# EasyEDA Pro project FPGA拓展板.epro

# Schematic Schematic1
Board Name: Board1; Create Date: 2025-09-13; Page Name: P1; Project Name: FPGA改; Schematic Name: Schematic1; Update Date: 2025-11-01; 项目名称: 111
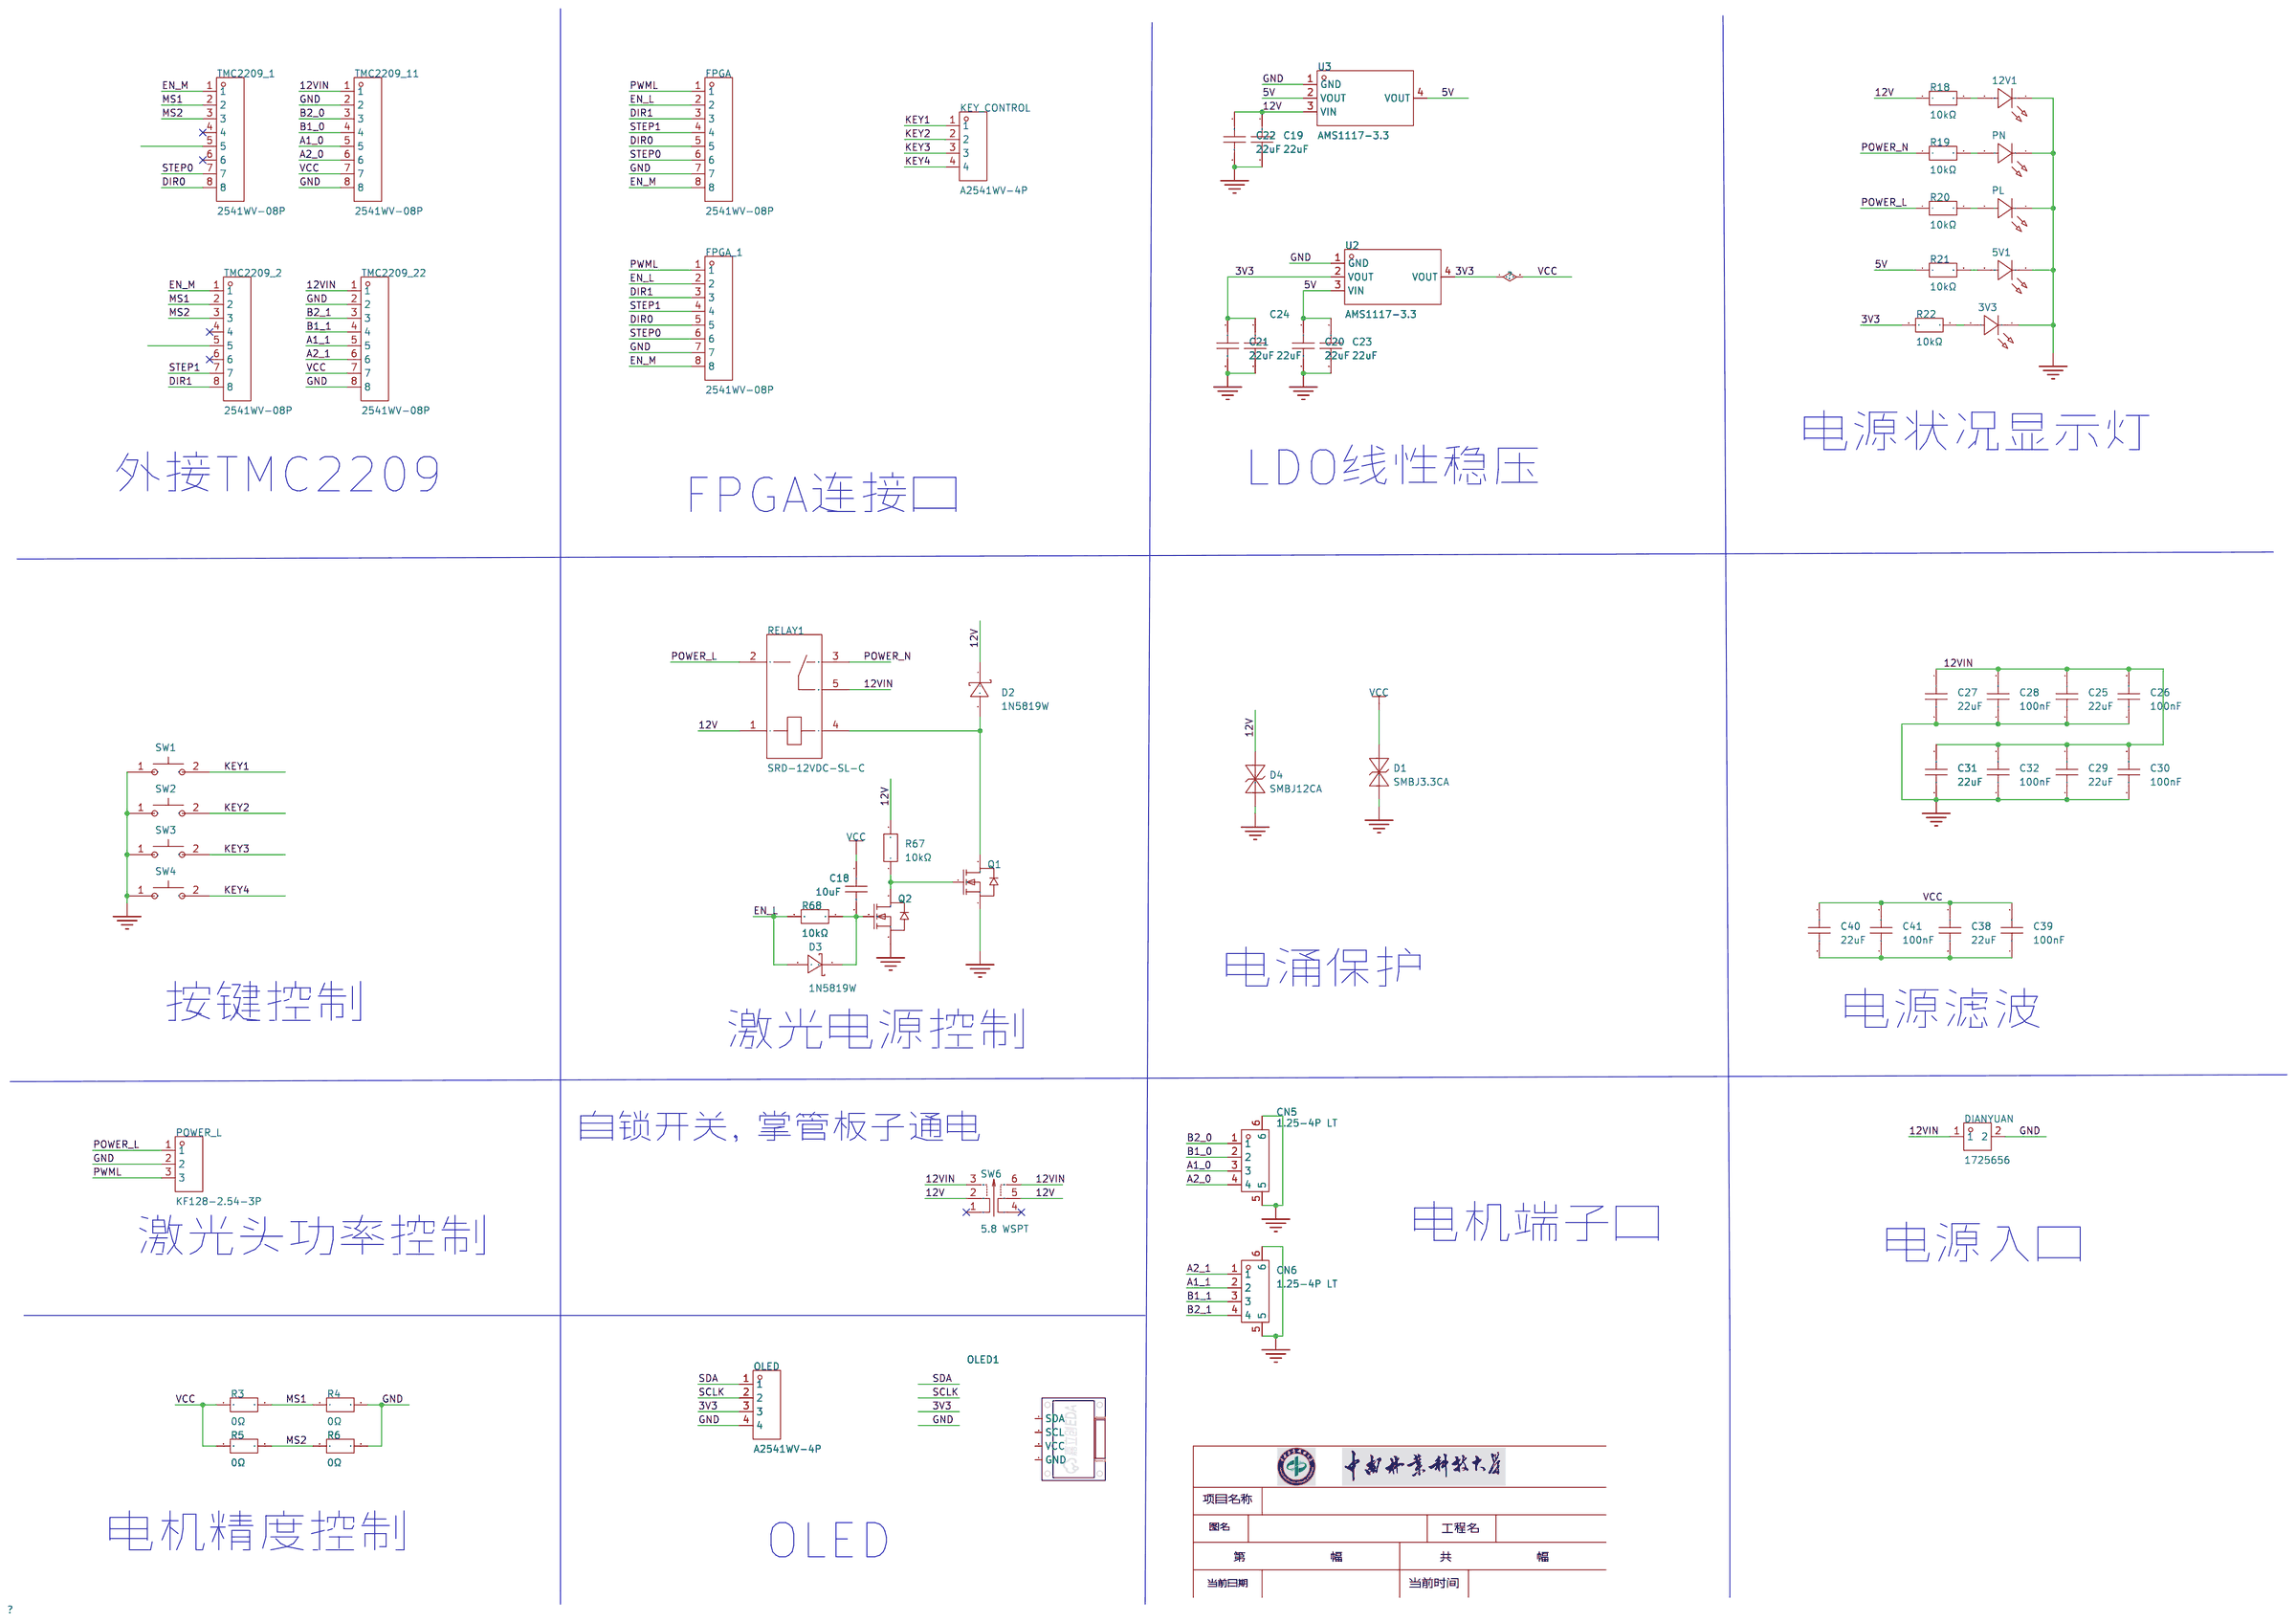
[diagram p0: schematic sheet]

## Parts
3V3  YLED0805R  [LED0603_GREEN]
5V1  YLED0805R  [LED0603_GREEN]
12V1  YLED0805R  [LED0603_GREEN]
C18  10uF  [C0805]
C19  22uF  [C0805]
C20  22uF  [C0805]
C21  22uF  [C0805]
C22  22uF  [C0805]
C23  22uF  [C0805]
C24  22uF  [C0805]
C25  22uF  [C0805]
C26  100nF  [C0603]
C27  22uF  [C0805]
C28  100nF  [C0603]
C29  22uF  [C0805]
C30  100nF  [C0603]
C31  22uF  [C0805]
C32  100nF  [C0603]
C38  22uF  [C0805]
C39  100nF  [C0603]
C40  22uF  [C0805]
C41  100nF  [C0603]
CN5  1.25-4P LT  [CONN-SMD_1.25-4PLT]
CN6  1.25-4P LT  [CONN-SMD_1.25-4PLT]
D1  SMBJ3.3CA  [SMB_L4.4-W3.5-LS5.2-BI]
D2  1N5819W  [SOD-123F_L2.8-W1.8-LS3.7-RD]
D3  1N5819W  [SOD-123F_L2.8-W1.8-LS3.7-RD]
D4  SMBJ12CA  [SMB_L4.4-W3.5-LS5.2-BI]
DIANYUAN  1725656  [CONN-TH_2P-P2.54_1725656]
FPGA  2541WV-08P  [HDR-TH_8P-P2.54-V-M-4]
FPGA_1  2541WV-08P  [HDR-TH_8P-P2.54-V-M-4]
KEY_CONTROL  A2541WV-4P  [HDR-TH_4P-P2.54-V-M]
OLED  A2541WV-4P  [HDR-TH_4P-P2.54-V-M]
OLED1  -  [0.96OLED_4P]
PL  YLED0805R  [LED0603_GREEN]
PN  YLED0805R  [LED0603_GREEN]
POWER_L  KF128-2.54-3P  [CONN-TH_3P-P2.54_KF128-2.54-3P]
Q1  AO3400  [SOT-23-3_L2.9-W1.3-P1.90-LS2.4-BL-2]
Q2  AO3400  [SOT-23-3_L2.9-W1.3-P1.90-LS2.4-BL-2]
R3  0Ω  [R0603]
R4  0Ω  [R0603]
R5  0Ω  [R0603]
R6  0Ω  [R0603]
R18  10kΩ  [R0603]
R19  10kΩ  [R0603]
R20  10kΩ  [R0603]
R21  10kΩ  [R0603]
R22  10kΩ  [R0603]
R67  10kΩ  [R0603]
R68  10kΩ  [R0603]
RELAY1  SRD-12VDC-SL-C  [RELAY-TH_SRD-XXVDC-XL-C]
SW1  TS-1807R-2016  [SW-SMD_L4.0-W2.9-LS4.8-1]
SW2  TS-1807R-2016  [SW-SMD_L4.0-W2.9-LS4.8-1]
SW3  TS-1807R-2016  [SW-SMD_L4.0-W2.9-LS4.8-1]
SW4  TS-1807R-2016  [SW-SMD_L4.0-W2.9-LS4.8-1]
SW6  5.8 WSPT  [SW-TH_6P-L5.8-W5.8-P2.00-LS4.5-TL_K8-5851E-L1]
TMC2209_1  2541WV-08P  [HDR-TH_8P-P2.54-V-M-4]
TMC2209_2  2541WV-08P  [HDR-TH_8P-P2.54-V-M-4]
TMC2209_11  2541WV-08P  [HDR-TH_8P-P2.54-V-M-4]
TMC2209_22  2541WV-08P  [HDR-TH_8P-P2.54-V-M-4]
U2  AMS1117-3.3  [SOT-223-3_L6.5-W3.4-P2.30-LS7.0-BR]
U3  AMS1117-3.3  [SOT-223-3_L6.5-W3.4-P2.30-LS7.0-BR]

## Library data of the parts
3V3 5V1 12V1 PL PN = YLED0805R: 发光颜色:红色;正向电压(VF):1.8V~2.4V;功率:60mW;正向电流:20mA;主波长:615nm~630nm;二极管配置:-;透镜颜色:-;色温:-;发光强度:-;发光角度:-;载带方式:-;工作温度:-40℃~+85℃;; Supplier Part: C19171391; Manufacturer: YONGYUTAI(永裕泰); Supplier Footprint: 0805; JLCPCB Part Class: 扩展库; Datasheet: https://atta.szlcsc.com/upload/public/pdf/source/20231027/AB486D22E6D71BC59190C48A798367E6.pdf; Supplier: LCSC; Emitted Color: 红色; Forward Voltage (VF): 1.8V~2.4V; Power Dissipation: 60mW; Forward Current: 20mA; Dominant Wavelength: 615nm~630nm; Peak Wavelength: 645nm; Operating Temperature: -40℃~+85℃
C18-C25 C27 C29 C31 C38 C40 = 0603B104J250NT: 容值:100nF;精度:±5%;额定电压:25V;材质(温度系数):X7R;; LCSC Part Name: 100nF ±5% 25V; Supplier Part: C2991729; Manufacturer: FH(风华); Supplier Footprint: 0603; JLCPCB Part Class: 扩展库; Datasheet: https://atta.szlcsc.com/upload/public/pdf/source/20200305/C486355_26A10D38EF8C2A5C37091D0039909270.pdf; Supplier: LCSC; Tolerance: ±5%; Voltage Rated: 25V; Temperature Coefficient: X7R
C26 C28 C30 C32 C39 C41 = CGA0805X7R104K500KT: 容值:100nF;精度:±10%;额定电压:50V;材质(温度系数):X7R;; LCSC Part Name: 100nF ±10% 50V; Supplier Part: C7503486; Manufacturer: HRE(芯声); Supplier Footprint: 0805; Supplier: LCSC; Tolerance: ±10%; Voltage Rated: 50V; Temperature Coefficient: X7R
CN5 CN6 = 1.25-4P LT: 插针结构:1x4P;间距:1.25mm;安装方式:立贴;参考系列:-;总PIN数:4P;排数:1;每排PIN数:4;行距:-;额定电流:1A;工作温度范围:-25℃~+85℃;; LCSC Part Name: 1x4P 间距:1.25mm 立贴; Supplier Part: C668611; Manufacturer: SHOU HAN(首韩); Supplier Footprint: SMD,P=1.25mm; JLCPCB Part Class: 扩展库; Datasheet: https://atta.szlcsc.com/upload/public/pdf/source/20200618/C668611_026C7E584C914A0046DD44314B22D2A4.pdf; Supplier: LCSC; Pins Structure: 1x4P; Pitch: 1.25mm; Mounting Style: 立贴; Number of Pins: 4P; Number of Rows: 1; Number of PINs Per Row: 4; Current Rating (Max): 1A; Operating Temperature Range: -25℃~+85℃
D1 D4 = SMBJ3.3CA_C5125668: 极性:双向;反向截止电压(Vrwm):3.3V;最大钳位电压:7.3V@50A;峰值脉冲电流(Ipp)@10/1000us:50A;峰值脉冲功率(Ppp)@10/1000us:600W;击穿电压:4.15V;; LCSC Part Name: TVS二极管; Supplier Part: C5125668; Manufacturer: BORN(伯恩半导体); Supplier Footprint: SMB(DO-214AA); JLCPCB Part Class: 扩展库; Datasheet: https://atta.szlcsc.com/upload/public/pdf/source/20231010/D8DA1EA3E2089A4B7A39163387B49BE4.pdf; Supplier: LCSC; polarity: 双向; Reverse Stand-Off Voltage (Vrwm): 3.3V; Maximum Clamping Voltage: 7.3V@50A; Peak Pulse Current (Ipp)@10/1000us: 50A; Peak Pulse Power Dissipation (Ppp)@10/1000us: 600W; Breakdown Voltage: 4.15V; Reverse Leakage Current (Ir): 20nA; Type: TVS
D2 D3 = 1N5819W_C169540: 正向压降(Vf):600mV@1A;直流反向耐压(Vr):40V;平均整流电流(Io):1A;; LCSC Part Name: 电压:40V 电流:1A; Supplier Part: C169540; Manufacturer: 晶导微电子; Supplier Footprint: SOD-123F; JLCPCB Part Class: 扩展库; Datasheet: https://atta.szlcsc.com/upload/public/pdf/source/20180316/CADAC6127F7EB1C6F7CC209B8BEF97B8.pdf; Supplier: LCSC; Forward Voltage (Vf@If): 600mV@1A; Reverse Voltage (Vr): 40V; Average Rectified Current (Io): 1A
DIANYUAN = 1725656: 间距:2.54mm;颜色:绿色;安装方式:直插;额定电流:6A;额定电压:125V;排数:1;每排PIN数:2;; LCSC Part Name: 2.54mm 排数:1 每排P数:2 直插; Supplier Part: C3029316; Manufacturer: Phoenix Contact(菲尼克斯); Supplier Footprint: 插件,P=2.54mm; JLCPCB Part Class: 扩展库; Datasheet: https://atta.szlcsc.com/upload/public/pdf/source/20220527/B7919393CBFBC9656D3D21F67F098F52.pdf; Supplier: LCSC; Pitch: 2.54mm; Color: 绿色; Mounting Style: 直插; Current Rating (Max): 6A; Voltage Rating (Max): 125V; Number of Pins: 2P; Number of Rows: 1; Number of PINs Per Row: 2
FPGA FPGA_1 TMC2209_1 TMC2209_2 TMC2209_11 TMC2209_22 = 2541WV-08P: 2.54间距单排直插插排针，塑高2.54，上针长度6.0，下针长3.0,08P; Supplier Part: C5383116; Manufacturer: HanElectricity(瀚源); Supplier Footprint: 插件,P=2.54mm; Datasheet: https://atta.szlcsc.com/upload/public/pdf/source/20230330/2BC52F76E32B2D45ECCE68ADA82449DD.pdf; Supplier: LCSC
KEY_CONTROL OLED = A2541WV-4P: 间距:2.54mm;总PIN位数:4;排数:1;插针结构:1x4P;行距:-;安装类型:直插;圆针/方针:方针;额定电流:-;额定电压:-;配合针长度:6mm;塑高:2.54mm;端接针长度:3mm;触头材质:黄铜;触头镀层:-;工作温度范围:-40℃~+105℃;颜色:黑色;; LCSC Part Name: 2.54mm 1x4P 直插 方针; Supplier Part: C225479; Manufacturer: CJT(长江连接器); Supplier Footprint: 直插,P=2.54mm; JLCPCB Part Class: Extended Part; Datasheet: https://atta.szlcsc.com/upload/public/pdf/source/20210317/C225479_66BE1F584C1491F50F59A7D7B65E2652.pdf; Supplier: LCSC; Pitch: 2.54mm; Number of Pins: 4; Number of Rows: 1; Pin Structure: 1x4P; Mounting Type: 直插; Circluar Pins/Square Pins: 方针; Length of Mating Pin: 6mm; Insulation Height: 2.54mm; Length of End Connection Pin: 3mm; Contact Material: 黄铜; Operating Temperature Range: -40℃~+105℃; Color: 黑色
OLED1 = 0.96OLED模块_4P: Supplier Footprint: 插件
POWER_L = KF128-2.54-3P: 结构:1x3P;间距:2.54mm;颜色:绿色;安装方式:直插;额定电流:8A;额定电压:130V;排数:1;线规 - AWG:18~26;线规 - 平方毫米:1;每排PIN数:3;工作温度范围:-40℃~+105℃;; LCSC Part Name: 2.54mm 1x3P 排数:1 每排P数:3 直插; Supplier Part: C474921; Manufacturer: KEFA(科发); Supplier Footprint: 插件,P=2.54mm; JLCPCB Part Class: 扩展库; Datasheet: https://atta.szlcsc.com/upload/public/pdf/source/20230317/0E5ECA9DB49110BC3219D12632CEA6EE.pdf; Supplier: LCSC; Structure: 1x3P; Pitch: 2.54mm; Color: 绿色; Mounting Style: 直插; Current Rating (Max): 8A; Voltage Rating (Max): 130V; Number of Pins: 3P; Number of Rows: 1; Wire Gauge - AWG: 18~26; Wire Gauge - mm2: 1; Number of PINs Per Row: 3; Operating Temperature Range: -40℃~+105℃
Q1 Q2 = AO3400: Supplier Part: C9900013365; Supplier Footprint: SOT-23; JLCPCB Part Class: 扩展库; Supplier: LCSC
R3-R6 R18-R22 R67 R68 = APC0805T1K00Z: 电阻类型:薄膜电阻;阻值:1kΩ;精度:±0.01%;功率:100mW;温度系数:±5ppm/℃;; LCSC Part Name: 薄膜电阻 1kΩ ±0.01% 100mW; Supplier Part: C6465829; Manufacturer: Ohmite; Supplier Footprint: 0805; Supplier: LCSC; Type: 薄膜电阻; Tolerance: ±0.01%; Power(Watts): 100mW; Temperature Coefficient: ±5ppm/℃; Operating Temperature Range: -55℃~+155℃
RELAY1 = SRD-12VDC-SL-C: 线圈电压:12V;触点形式:一组转换:1C(单刀双掷-转换);触点容量(电阻负载):-;最大切换电压:250V@AC;最大切换电流:15A;; Supplier Part: C30431; Manufacturer: 松乐; Supplier Footprint: 插件,15.6x19.2mm; JLCPCB Part Class: 扩展库; Datasheet: https://atta.szlcsc.com/upload/public/pdf/source/20200305/C490149_C96E4098A3B1FFB377D5AD2E40B7C2A8.pdf; Supplier: LCSC; Coil Voltage: 12V; Contact Form: 一组转换:1C(单刀双掷-转换); Pin Number: 5; Maximum Switching Voltage: 250V@AC; Coil Rated Power: 360mW; Maximum Switching Current: 15A; Coil Type: 无极性-单线圈; Coil Resistance: 400Ω; Contact Resistance: 100mΩ; Operate Time: 10ms; Release Time: 10ms
SW1-SW4 = TS-1807R-2016: 触点电流:25mA;额定电压(DC):24V;电路结构:单刀单掷;安装方式:立贴;作用力:1.6N;机械寿命:6万次;; LCSC Part Name: 4*3*2mm 立贴 轻触开关; Supplier Part: C596278; Manufacturer: SOFNG(硕方); Supplier Footprint: SMD; JLCPCB Part Class: 扩展库; Datasheet: https://atta.szlcsc.com/upload/public/pdf/source/20200609/C596278_4140942BE2C43E125A1525DC6778F69A.pdf; Supplier: LCSC; Contact Current: 25mA; Voltage Rating (DC): 24V; Circuit: 单刀单掷; Mounting Style: 立贴; Actuator Style: 圆形按钮; Actuator/Cap Color: 黑色; Operating Force: 1.6N; Mechanical Life: 6万次; Operating Temperature: -35℃~+75℃; Switch Length: 4mm; Switch Width: 3mm; Switch Height: 2mm
SW6 = 5.8 WSPT: 电路结构:双刀双掷;自锁/无锁:无锁;安装方式:直插;触点电流:100mA;额定电压 (AC):-;额定电压 (DC):30V;带灯:不带;作用力:180gf;机械寿命:5千次;; LCSC Part Name: 按键开关5.8x5.8 无锁平头 180gf; Supplier Part: C5379898; Manufacturer: SHOU HAN(首韩); Supplier Footprint: 插件; Datasheet: https://atta.szlcsc.com/upload/public/pdf/source/20230323/C831DDA43A625CDC196CB35781CDAE7F.pdf; Supplier: LCSC; Circuit: 双刀双掷; Self Lock / No Lock: 无锁; Actuator Style: 矩形柱塞; Mounting Style: 直插; Contact Current: 100mA; Voltage Rating (DC): 30V; Insulation Resistance: 100MΩ; Actuator/Cap Color: 蓝色; With Lamp: 不带; Pin Style: PC引脚; Operating Force: 180gf; Operating Temperature: -10℃~+70℃; Mechanical Life: 5千次
U2 U3 = AMS1117-3.3_C6186: 输出类型:固定;最大输入电压:-;输出电压:3.3V;最大输出电流:1A;电源纹波抑制比(PSRR):72dB@(120Hz);输出极性:正极;; LCSC Part Name: 输出3.3V 1A; Supplier Part: C6186; Manufacturer: AMS; Supplier Footprint: SOT-223-3; JLCPCB Part Class: 基础库; Datasheet: https://atta.szlcsc.com/upload/public/pdf/source/20180727/C6186_7A095716F0823C02F1997A905E26C086.pdf; Supplier: LCSC; Output Type: 固定; Output Voltage: 3.3V; MAX Output Current: 1A; Power Supply Rejection Ratio (PSRR): 72dB@(120Hz); Dropout Voltage: 1.3V@(800mA); Output Polarity: 正极; Number of Outputs: 1

## Nets
5V: C20.1 C23.1 R21.1 U2.3(VIN) U3.2(VOUT) U3.4(VOUT)
12V: C19.1 C22.1 D2.1 D4.2 R18.1 R67.2 RELAY1.1 SW6.2 SW6.5 U3.3(VIN)
12VIN: C25.1 C26.2 C27.1 C28.2 C29.1 C30.2 C31.1 C32.2 DIANYUAN.1 RELAY1.5 SW6.3 SW6.6 TMC2209_11.1 TMC2209_22.1
GND: 3V3.1(K) 5V1.1(K) 12V1.1(K) C19.2 C20.2 C21.2 C22.2 C23.2 C24.2 C25.2 C26.1 C27.2 C28.1 C29.2 C30.1 C31.2 C32.1 CN5.5 CN5.6 CN6.5 CN6.6 D1.1 D4.1 DIANYUAN.2 FPGA.7 FPGA_1.7 OLED.4 PL.1(K) PN.1(K) POWER_L.2 Q1.2(S) Q2.2(S) R4.2 R6.2 SW1.1 SW2.1 SW3.1 SW4.1 TMC2209_11.2 TMC2209_11.8 TMC2209_22.2 TMC2209_22.8 U2.1(GND) U3.1(GND)
VCC: C18.1 C21.1 C24.1 C38.1 C39.2 C40.1 C41.2 D1.2 OLED.3 R3.1 R5.1 R22.1 TMC2209_11.7 TMC2209_22.7 U2.2(VOUT) U2.4(VOUT)
A1_0: CN5.3 TMC2209_11.5
A1_1: CN6.2 TMC2209_22.5
A2_0: CN5.4 TMC2209_11.6
A2_1: CN6.1 TMC2209_22.6
B1_0: CN5.2 TMC2209_11.4
B1_1: CN6.3 TMC2209_22.4
B2_0: CN5.1 TMC2209_11.3
B2_1: CN6.4 TMC2209_22.3
DIR0: FPGA.5 FPGA_1.5 TMC2209_1.8
DIR1: FPGA.3 FPGA_1.3 TMC2209_2.8
EN_L: D3.2 FPGA.2 FPGA_1.2 R68.2
EN_M: FPGA.8 FPGA_1.8 TMC2209_1.1 TMC2209_2.1
KEY1: KEY_CONTROL.1 SW1.2
KEY2: KEY_CONTROL.2 SW2.2
KEY3: KEY_CONTROL.3 SW3.2
KEY4: KEY_CONTROL.4 SW4.2
MS1: R3.2 R4.1 TMC2209_1.2 TMC2209_2.2
MS2: R5.2 R6.1 TMC2209_1.3 TMC2209_2.3
POWER_L: POWER_L.1 R20.1 RELAY1.2
POWER_N: R19.1 RELAY1.3
PWML: FPGA.1 FPGA_1.1 POWER_L.3
SCLK: OLED.2
SDA: OLED.1
STEP0: FPGA.6 FPGA_1.6 TMC2209_1.7
STEP1: FPGA.4 FPGA_1.4 TMC2209_2.7
$1N1478: D2.2 Q1.3(D) RELAY1.4
$1N1491: Q1.1(G) Q2.3(D) R67.1
$1N1495: C18.2 D3.1 Q2.1(G) R68.1
$1N2877: 12V1.2(A) R18.2
$1N2880: 5V1.2(A) R21.2
$1N3529: C38.2 C39.1 C40.2 C41.1
$1N8867: 3V3.2(A) R22.2
Net-(PL-2): PL.2(A) R20.2
Net-(PN-2): PN.2(A) R19.2

Not connected (* = marked no-connect by the designer): OLED1 1(GND) 2(VCC) 3(SCL) 4(SDA); SW6 1* 4*; TMC2209_1 4* 5 6*; TMC2209_2 4* 5 6*

## Notes on the sheet
- 电源状况显示灯
- LDO线性稳压
- 外接TMC2209
- FPGA连接口
- 电涌保护
- 按键控制
- 电源滤波
- 激光电源控制
- 自锁开关，掌管板子通电
- 电机端子口
- 激光头功率控制
- 电源入口
- 电机精度控制
- OLED

# Board PCB1
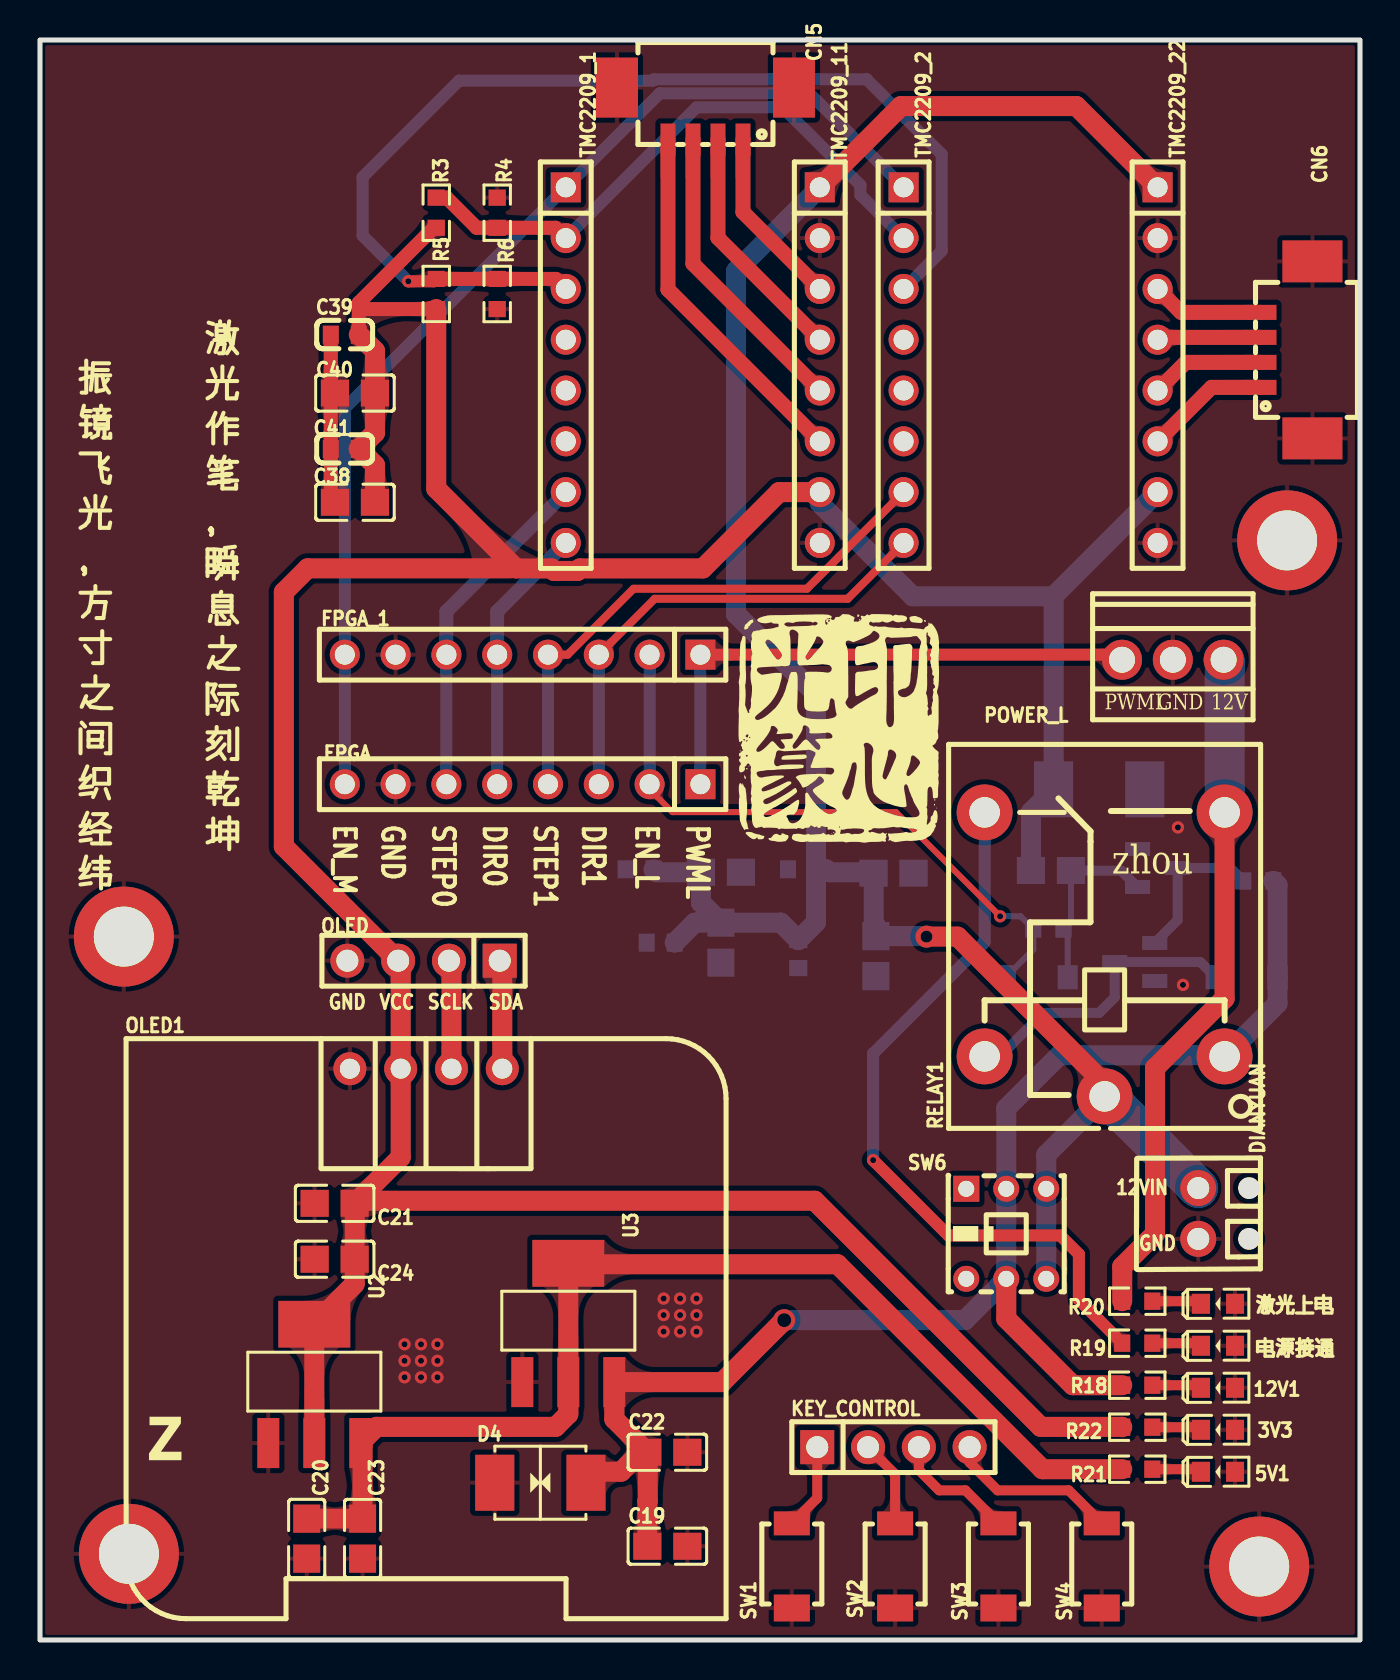
[diagram p1: board, top side]
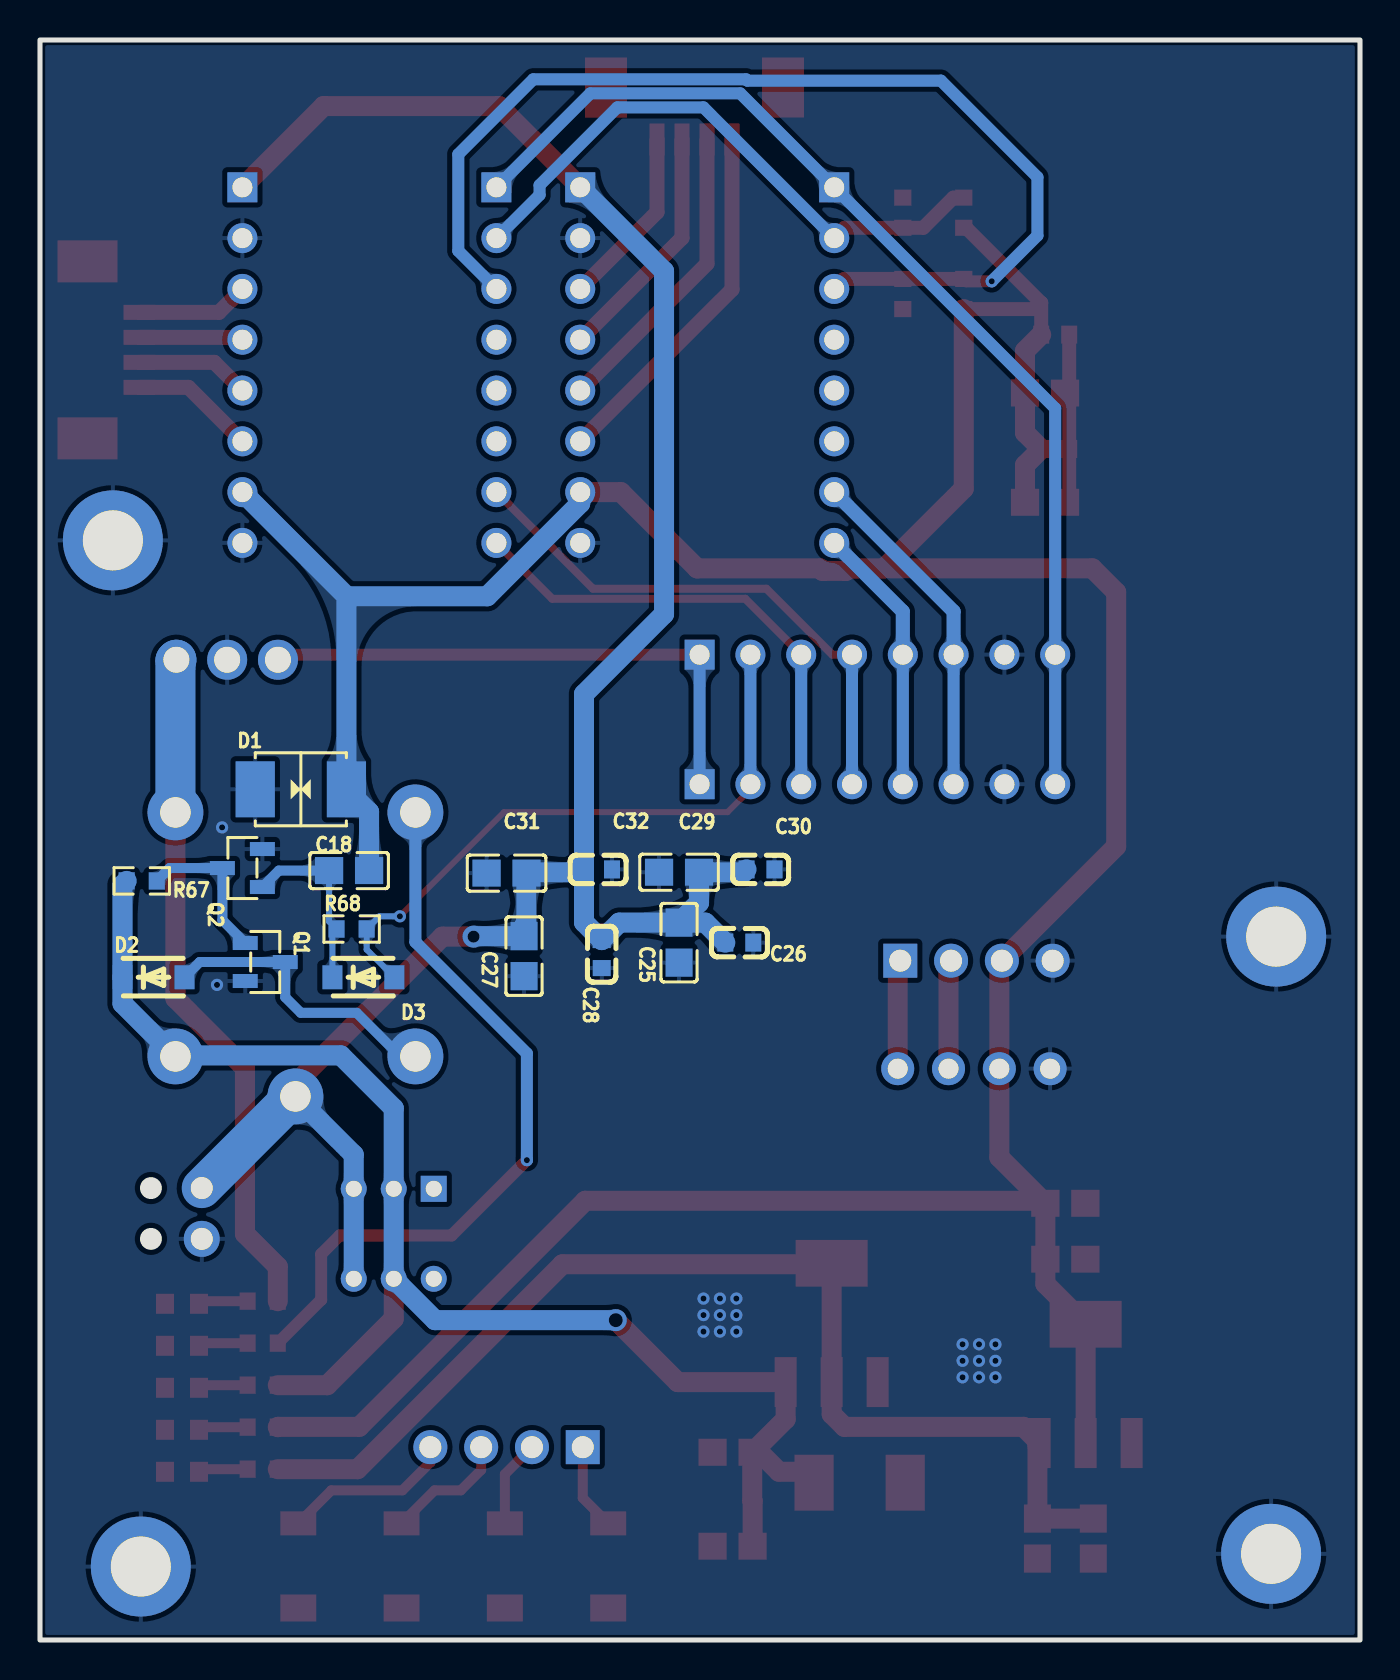
[diagram p2: board, bottom side, seen from below]

Outline 66 x 80 mm; copper layers: Top Layer, Bottom Layer. Coordinates in mm from the lower left corner of the outline.
Outline path: rectangle 0,80 66,0
Stack: Top Layer 0.035mm / Dielectric1 1.51mm FR4 er 4.5 / Bottom Layer 0.035mm

## Design rules (mm)
template: JLCPCB Capability(Two Layers Board)
spacing copperThickness1oz (default): track to track 0.102, other pairs 0.152 to 0.3
spacing copperThickness2oz: track to track 0.203, other pairs 0.152 to 0.3
track width copperThickness1oz (default): min 0.127, default 0.254, max 2.54
track width copperThickness2oz: min 0.203, default 0.254, max 2.54
differential pair differentialPair (default): width min 0.127, default 0.254, max 2.54; gap min 0.152, default 0.152
via viaSize (default): diameter min 0.5, default 0.61, max 10; hole min 0.3, default 0.305, max 6.3

## Placement (name value [footprint] x y rotation side)
3V3  YLED0805R  [LED0603_GREEN]  58.9 10.51 180 top
5V1  YLED0805R  [LED0603_GREEN]  58.9 8.41 180 top
12V1  YLED0805R  [LED0603_GREEN]  58.9 12.61 180 top
C18  10uF  [C0805]  50.55 38.47 0 bottom
C19  22uF  [C0805]  31.37 4.69 0 top
C20  22uF  [C0805]  13.33 5.07 270 top
C21  22uF  [C0805]  14.73 21.83 180 top
C22  22uF  [C0805]  31.37 9.39 0 top
C23  22uF  [C0805]  16.13 5.07 270 top
C24  22uF  [C0805]  14.73 19.04 180 top
C25  22uF  [C0805]  34.05 34.87 270 bottom
C26  100nF  [C0603]  31.04 34.87 0 bottom
C27  22uF  [C0805]  41.8 34.19 270 bottom
C28  100nF  [C0603]  37.91 34.3 90 bottom
C29  22uF  [C0805]  34.05 38.39 0 bottom
C30  100nF  [C0603]  29.98 38.53 0 bottom
C31  22uF  [C0805]  42.67 38.34 0 bottom
C32  100nF  [C0603]  38.1 38.53 0 bottom
C38  22uF  [C0805]  15.75 56.89 180 top
C39  100nF  [C0603]  15.24 65.27 0 top
C40  22uF  [C0805]  15.75 62.35 180 top
C41  100nF  [C0603]  15.24 59.55 0 top
CN5  1.25-4P LT  [CONN-SMD_1.25-4PLT]  33.27 76.32 0 top
CN6  1.25-4P LT  [CONN-SMD_1.25-4PLT]  62.32 64.51 270 top
D1  SMBJ3.3CA  [SMB_L4.4-W3.5-LS5.2-BI]  52.96 42.54 180 bottom
D2  1N5819W  [SOD-123F_L2.8-W1.8-LS3.7-RD]  60.33 33.14 180 bottom
D3  1N5819W  [SOD-123F_L2.8-W1.8-LS3.7-RD]  49.83 33.14 180 bottom
D4  SMBJ12CA  [SMB_L4.4-W3.5-LS5.2-BI]  25.02 7.86 0 top
DIANYUAN  1725656  [CONN-TH_2P-P2.54_1725656]  57.91 21.33 270 top
FPGA  2541WV-08P  [HDR-TH_8P-P2.54-V-M-4]  24.13 42.79 180 top
FPGA_1  2541WV-08P  [HDR-TH_8P-P2.54-V-M-4]  24.13 49.27 180 top
KEY_CONTROL  A2541WV-4P  [HDR-TH_4P-P2.54-V-M]  42.67 9.64 0 top
NOREF  -  [Pad_e449]  4.19 35.17 0 top
NOREF#2  -  [Pad_e502]  4.45 4.31 0 top
NOREF#3  -  [Pad_e452]  60.96 3.67 0 top
NOREF#4  -  [Pad_e451]  62.36 54.98 0 top
OLED  A2541WV-4P  [HDR-TH_4P-P2.54-V-M]  19.18 33.96 180 top
OLED1  -  [0.96OLED_4P]  19.3 28.57 0 top
POWER_L  KF128-2.54-3P  [CONN-TH_3P-P2.54_KF128-2.54-3P]  56.64 49.01 180 top
Q1  AO3400  [SOT-23-3_L2.9-W1.3-P1.90-LS2.4-BL-2]  54.74 33.9 270 bottom
Q2  AO3400  [SOT-23-3_L2.9-W1.3-P1.90-LS2.4-BL-2]  55.88 38.6 90 bottom
R3  0Ω  [R0603]  19.81 71.36 90 top
R4  0Ω  [R0603]  22.86 71.36 90 top
R5  0Ω  [R0603]  19.81 67.3 90 top
R6  0Ω  [R0603]  22.86 67.3 270 top
R18  10kΩ  [R0603]  54.86 12.74 0 top
R19  10kΩ  [R0603]  54.86 14.84 0 top
R20  10kΩ  [R0603]  54.86 16.94 0 top
R21  10kΩ  [R0603]  54.86 8.54 0 top
R22  10kΩ  [R0603]  54.86 10.64 0 top
R67  10kΩ  [R0603]  60.91 37.95 0 bottom
R68  10kΩ  [R0603]  50.42 35.55 180 bottom
RELAY1  SRD-12VDC-SL-C  [RELAY-TH_SRD-XXVDC-XL-C]  53.23 34.28 90 top
SW1  TS-1807R-2016  [SW-SMD_L4.0-W2.9-LS4.8-1]  37.59 3.8 90 top
SW2  TS-1807R-2016  [SW-SMD_L4.0-W2.9-LS4.8-1]  42.76 3.8 90 top
SW3  TS-1807R-2016  [SW-SMD_L4.0-W2.9-LS4.8-1]  47.92 3.8 90 top
SW4  TS-1807R-2016  [SW-SMD_L4.0-W2.9-LS4.8-1]  53.09 3.8 90 top
SW6  5.8 WSPT  [SW-TH_6P-L5.8-W5.8-P2.00-LS4.5-TL_K8-5851E-L1]  48.31 20.31 0 top
TMC2209_1  2541WV-08P  [HDR-TH_8P-P2.54-V-M-4]  26.29 63.74 270 top
TMC2209_2  2541WV-08P  [HDR-TH_8P-P2.54-V-M-4]  43.18 63.74 270 top
TMC2209_11  2541WV-08P  [HDR-TH_8P-P2.54-V-M-4]  38.99 63.74 270 top
TMC2209_22  2541WV-08P  [HDR-TH_8P-P2.54-V-M-4]  55.88 63.74 270 top
U2  AMS1117-3.3  [SOT-223-3_L6.5-W3.4-P2.30-LS7.0-BR]  13.72 12.82 270 top
U3  AMS1117-3.3  [SOT-223-3_L6.5-W3.4-P2.30-LS7.0-BR]  26.42 15.87 270 top
激光上电  YLED0805R  [LED0603_GREEN]  58.9 16.81 180 top
电源连接  YLED0805R  [LED0603_GREEN]  58.9 14.71 180 top

## Footprints (pads in the part's own frame, mm; a bottom-side part is the same pattern mirrored in y, then rotated)
0.96OLED_4P
  round 1.65 hole 1: 1(-3.81,-0.002) 2(-1.27,0.002) 3(1.27,0.002) 4(3.81,0.002)
C0603
  rect 0.8x0.9 smd: 1(-0.7,0) 2(0.7,0)
C0805
  rect 1.41x1.35 smd: 1(-1,0) 2(1,0)
CONN-SMD_1.25-4PLT
  rect 0.75x1.6 smd: 1(1.875,-1.3) 2(0.625,-1.3) 3(-0.625,-1.3) 4(-1.875,-1.3)
  rect 2.1x3 smd: 5(4.425,1.3) 6(-4.425,1.3)
CONN-TH_2P-P2.54_1725656
  round 1.8 hole 1.1: 1(-1.27,0) 2(1.27,0)
CONN-TH_3P-P2.54_KF128-2.54-3P
  round 2 hole 1.3: 1(-2.54,0) 2(0,0) 3(2.54,0)
HDR-TH_4P-P2.54-V-M
  rect 1.7x1.7 hole 1.1: 1(-3.81,0)
  round 1.7 hole 1.1: 2(-1.27,0) 3(1.27,0) 4(3.81,0)
HDR-TH_8P-P2.54-V-M-4
  rect 1.5x1.5 hole 1: 1(-8.89,0)
  round 1.5 hole 1: 2(-6.35,0) 3(-3.81,0) 4(-1.27,0) 5(1.27,0) 6(3.81,0) 7(6.35,0) 8(8.89,0)
LED0603_GREEN
  rect 0.9x1 smd: 1(-0.85,0) 2(0.85,0)
Pad_e449
  round 5 hole 3: 1(0,0)
Pad_e451
  round 5 hole 3: 2(0,0)
Pad_e452
  round 5 hole 3: 3(0,0)
Pad_e502
  round 5 hole 3: 4(0,0)
R0603
  rect 0.806x0.864 smd: 1(-0.753,0) 2(0.753,0)
RELAY-TH_SRD-XXVDC-XL-C
  round 2.794 hole 1.524: 1(-5.1,-6) 2(7.1,-6) 3(7.1,6) 4(-5.1,6) 5(-7.1,0)
SMB_L4.4-W3.5-LS5.2-BI
  rect 1.96x2.8 smd: 1(-2.28,0) 2(2.28,0)
SOD-123F_L2.8-W1.8-LS3.7-RD
  rect 1x1.2 smd: 1(-1.55,0) 2(1.55,0)
SOT-23-3_L2.9-W1.3-P1.90-LS2.4-BL-2
  rect 0.7x1.25 smd: 1(-0.95,-1) 2(0.95,-1) 3(0,1)
SOT-223-3_L6.5-W3.4-P2.30-LS7.0-BR
  rect 2.5x1.1 smd: 1(2.97,-2.3) 2(2.97,0) 3(2.97,2.3)
  rect 2.34x3.6 smd: 4(-2.97,0)
SW-SMD_L4.0-W2.9-LS4.8-1
  rect 1.35x1.8 smd: 1(-2.2,0)
  rect 1.2x1.8 smd: 2(2.032,0)
SW-TH_6P-L5.8-W5.8-P2.00-LS4.5-TL_K8-5851E-L1
  rect 1.3x1.3 hole 0.8: 1(-2,2.25)
  round 1.3 hole 0.8: 2(0,2.25) 3(2,2.25) 4(-2,-2.25) 5(0,-2.25) 6(2,-2.25)

## Nets
As in the schematic, except:
GND: 3V3.1 5V1.1 12V1.1 C19.2 C20.2 C21.2 C22.2 C23.2 C24.2 C25.2 C26.1 C27.2 C28.1 C29.2 C30.1 C31.2 C32.1 CN5.5 CN5.6 CN6.5 CN6.6 D1.1 D4.1 DIANYUAN.2 FPGA.7 FPGA_1.7 NOREF.1 NOREF#2.4 NOREF#3.3 NOREF#4.2 OLED.4 OLED1.1 POWER_L.2 Q1.2 Q2.2 R4.2 R6.2 SW1.1 SW2.1 SW3.1 SW4.1 TMC2209_11.2 TMC2209_11.8 TMC2209_22.2 TMC2209_22.8 U2.1 U3.1 激光上电.1 电源连接.1
VCC: C18.1 C21.1 C24.1 C38.1 C39.2 C40.1 C41.2 D1.2 OLED.3 OLED1.2 R3.1 R5.1 R22.1 TMC2209_11.7 TMC2209_22.7 U2.2 U2.4
SCLK: OLED.2 OLED1.3
SDA: OLED.1 OLED1.4
$1N2878: R19.2 电源连接.2
$1N2879: R20.2 激光上电.2

Pads without a net: SW6 1 4; TMC2209_1 4 6; TMC2209_2 4 6

## Via types
v1: diameter 0.61, hole 0.305, Top Layer to Bottom Layer, 23 vias
v2: diameter 1.1, hole 0.7, Top Layer to Bottom Layer, 1 via
v3: diameter 1.1, hole 0.6, Top Layer to Bottom Layer, 1 via

## Routing (per net, layer and track width the routed paths; a pad name or vN(x,y) marks a point on that pad's centre or on a via; arc(x,y) is an arc through that point)
5V: length 57.1
  Top Layer w1: R21.1 50.12,8.54 39.88,18.79 26.46,18.79 U3.4 U3.2 26.42,11.29 25.78,10.66 16.83,10.66 U2.3 16.13,9.73 C23.1 C20.1
12V: length 73.6
  Top Layer w1: C22.1 28.72,11.04 U3.3 34.11,12.9 v2(37.21,15.99) ; C22.1 30.39,9.37 30.39,6.96 30.37,6.95 C19.1 ; C22.1 30.03,9.39 29.05,8.41 27.64,8.41 27.55,8.5 ; R18.1 51.64,12.74 48.31,16.07 SW6.5
  Bottom Layer w1: R67.2 61.88,37.75 D2.1 61.88,31.83 RELAY1.1 59.18,29.23 50.96,29.23 48.31,26.59 SW6.2 SW6.5 46.24,15.99 v2(37.21,15.99)
12VIN: length 112.2
  Top Layer w1: v3(44.32,35.17) 45.88,35.17 53.23,27.82 RELAY1.5 ; TMC2209_11.1 43.05,76.7 51.82,76.7 TMC2209_22.1
  Bottom Layer w1: C25.1 32.74,35.87 C26.2 ; C25.1 33.05,36.87 C29.1 30.82,38.39 C30.2 ; C25.1 37.04,35.87 C28.2 38.8,35.88 C32.2 ; SW6.6 SW6.3 50.31,24.26 RELAY1.5 ; C32.2 38.8,47.3 34.8,51.3 34.8,68.44 TMC2209_11.1 ; C32.2 39.31,38.53 39.45,38.39 41.68,38.39 41.68,35.82 41.8,35.7 C27.1 44.3,35.19 v3(44.32,35.17)
  Bottom Layer w2: DIANYUAN.1 53.33,27.18 RELAY1.5
GND:
  vias: v1(18.23,14.79) v1(18.23,13.96) v1(18.23,13.13) v1(19.05,14.79) v1(19.05,13.96) v1(19.05,13.13) v1(19.87,14.79) v1(19.87,13.96) v1(19.87,13.13) v1(31.18,17.07) v1(31.18,16.25) v1(31.18,15.42) v1(32,17.07) v1(32,16.25) v1(32,15.42) v1(32.83,17.07) v1(32.83,16.25) v1(32.83,15.42) v1(56.9,40.63) v1(57.15,32.76)
VCC: length 188.9
  Top Layer w0.7: 15.94,66.86 16.25,66.55 R5.1 ; 15.94,66.86 C39.2 ; 15.94,66.86 19.69,70.61 R3.1
  Top Layer w1: 15.86,21.96 38.73,21.96 50.04,10.66 54.09,10.66 R22.1 ; 15.86,21.96 C21.1 C24.1 15.73,17.8 U2.4 U2.2 ; 15.86,21.96 18.03,24.14 OLED1.2 18.03,33.84 OLED.3 12.19,39.68 12.19,52.39 13.38,53.58 23.53,53.58 ; TMC2209_11.7 36.96,57.39 33.14,53.58 27,53.58 26.87,53.45 25.71,53.45 25.58,53.58 23.8,53.58 19.81,57.57 R5.1 ; C38.1 16.75,58.75 C41.2 16.75,60.36 C40.1 16.75,64.46 C39.2
  Bottom Layer w1: TMC2209_11.7 38.99,56.84 43.64,52.19 50.42,52.19 ; C18.1 49.55,41.4 D1.2 50.68,52.19 TMC2209_22.7
A1_0: length 15.2
  Top Layer w0.75: TMC2209_11.5 32.65,68.81 CN5.3
A1_1: length 5.7
  Top Layer w0.75: 61.02,63.88 57.29,63.88 TMC2209_22.5
A2_0: length 18.2
  Top Layer w0.75: CN5.4 31.4,67.52 TMC2209_11.6
A2_1: length 6.3
  Top Layer w0.75: 61.02,62.63 58.58,62.63 TMC2209_22.6
B1_0: length 12.1
  Top Layer w0.75: CN5.2 33.9,70.1 TMC2209_11.4
B1_1: length 5.2
  Top Layer w0.75: 61.02,65.13 56,65.13 TMC2209_22.4
B2_0: length 9.1
  Top Layer w0.75: TMC2209_11.3 35.15,71.39 CN5.1
B2_1: length 5.6
  Top Layer w0.75: 61.02,66.38 57.05,66.38 TMC2209_22.3
DIR0: length 13.5
  Bottom Layer w0.6: FPGA_1.5 FPGA.5
  Bottom Layer w0.7: FPGA_1.5 22.86,51.43 TMC2209_1.8
DIR1: length 24
  Top Layer w0.4: TMC2209_2.8 40.39,52.06 30.73,52.06 FPGA_1.3
  Bottom Layer w0.6: FPGA_1.3 FPGA.3
EN_L: length 31.8
  Top Layer w0.3: FPGA.2 30.48,42.54 31.62,41.39 42.8,41.39 v1(48.01,36.19)
  Bottom Layer w0.3: v1(48.01,36.19) 49.03,36.19 R68.2 49.67,34.52 D3.2
  Bottom Layer w0.6: FPGA.2 FPGA_1.2
EN_M: length 55.2
  Bottom Layer w0.6: FPGA.8 FPGA_1.8 15.24,61.59 TMC2209_1.1 30.99,77.33 38.48,77.33 TMC2209_2.1
KEY1: length 4.3
  Top Layer w0.5: KEY_CONTROL.1 38.86,7.1 SW1.2
KEY2: length 4.4
  Top Layer w0.5: KEY_CONTROL.2 42.76,8.29 SW2.2
KEY3: length 6.2
  Top Layer w0.5: KEY_CONTROL.3 43.94,8.5 44.96,7.48 46.27,7.48 SW3.2
KEY4: length 8.6
  Top Layer w0.5: SW4.2 51.43,7.48 47.88,7.48 46.48,8.88 KEY_CONTROL.4
MS1: length 29.9
  Top Layer w0.7: TMC2209_1.2 25.77,70.61 R4.1 21.84,70.61 20.33,72.12 R3.2
  Bottom Layer w0.6: TMC2209_2.2 41.02,72.25 41.02,72.74 37.13,76.63 32.83,76.63 TMC2209_1.2
MS2: length 54.3
  Top Layer w0.6: R5.2 19.69,67.94 v1(18.42,67.94)
  Top Layer w0.7: TMC2209_1.3 25.79,68.05 R6.1 R5.2
  Bottom Layer w0.6: TMC2209_2.3 45.08,69.46 45.08,74.29 41.33,78.04 30.7,78.04 30.63,77.97 20.95,77.97 16.13,73.14 16.13,70.22 v1(18.42,67.94)
POWER_L: length 34.2
  Top Layer w1: RELAY1.2 59.23,32.08 55.75,28.6 55.75,20.31 54.11,18.67 R20.1
  Bottom Layer w2: RELAY1.2 59.23,48.96 POWER_L.1
POWER_N: length 37.3
  Top Layer w0.6: v1(41.66,23.99) 45.42,20.23 51.01,20.23 51.94,19.29 51.94,17.01 R19.1
  Bottom Layer w0.6: v1(41.66,23.99) 41.66,29.33 47.23,34.9 RELAY1.3
PWML: length 27.7
  Top Layer w0.6: FPGA_1.1 53.85,49.27 POWER_L.3
  Bottom Layer w0.6: FPGA.1 FPGA_1.1
SCLK: length 5.5
  Top Layer w1: OLED1.3 20.57,33.84 OLED.2
SDA: length 5.5
  Top Layer w1: OLED1.4 23.11,33.84 OLED.1
STEP0: length 17.1
  Bottom Layer w0.6: FPGA.6 FPGA_1.6
  Bottom Layer w0.7: TMC2209_1.7 20.32,51.43 FPGA_1.6
STEP1: length 27.6
  Top Layer w0.4: TMC2209_2.7 38.35,52.56 29.68,52.56 26.38,49.27 FPGA_1.4
  Bottom Layer w0.6: FPGA.4 FPGA_1.4
$1N1478: length 14.8
  Bottom Layer w0.5: RELAY1.4 47.99,29.18 50.17,31.36 52.96,31.36 53.74,32.14 Q1.3 58.01,33.9 D2.2
$1N1491: length 7.8
  Bottom Layer w0.5: R67.1 59.52,38.6 Q2.3 56.88,35.99 Q1.1
$1N1495: length 9.2
  Bottom Layer w0.3: C18.2 51.55,35.92 R68.1 51.38,35.34 D3.1
  Bottom Layer w0.5: C18.2 54.06,38.47 Q2.1
$1N2877: length 2.5
  Top Layer w0.5: 12V1.2 57.92,12.74 R18.2
$1N2878: length 2.5
  Top Layer w0.5: R19.2 57.92,14.84 电源连接.2
$1N2879: length 2.5
  Top Layer w0.5: R20.2 57.92,16.94 激光上电.2
$1N2880: length 2.5
  Top Layer w0.5: R21.2 57.92,8.54 5V1.2
$1N3529: length 8.6
  Top Layer w0.7: C38.2 14.54,57.09 C41.1 14.54,62.14 C40.2 14.54,62.55 C39.1
$1N8867: length 2.5
  Top Layer w0.5: 3V3.2 57.92,10.64 R22.2

## Copper pours and planes (outline as drawn; the poured copper is in the pictures)
GND on Top Layer: -9.65,87.11 73.28,87.11 73.28,-5.98 -9.65,-5.98
GND on Bottom Layer: -5.46,86.86 71.88,86.86 71.88,-5.98 -5.46,-5.98

Small or netless copper shapes (teardrops, artwork), in the pictures only: 109 on Top Layer, 81 on Bottom Layer

## Text on the board
Top Silkscreen Layer: GND | VCC | SCLK | SDA | 12VIN | EN_M | STEP0 | DIR0 | STEP1 | DIR1 | EN_L | PWML | Z | zhou | 12V | 激光上电 | 电源接通 | 振 / 镜 / 飞 / 光 / ， / 方 / 寸 / 之 / 间 / 织 / 经 / 纬 | 激 / 光 / 作 / 笔 / ， / 瞬 / 息 / 之 / 际 / 刻 / 乾 / 坤
